# EAGLE design Haar_Primal (EAGLE 9.5.2)
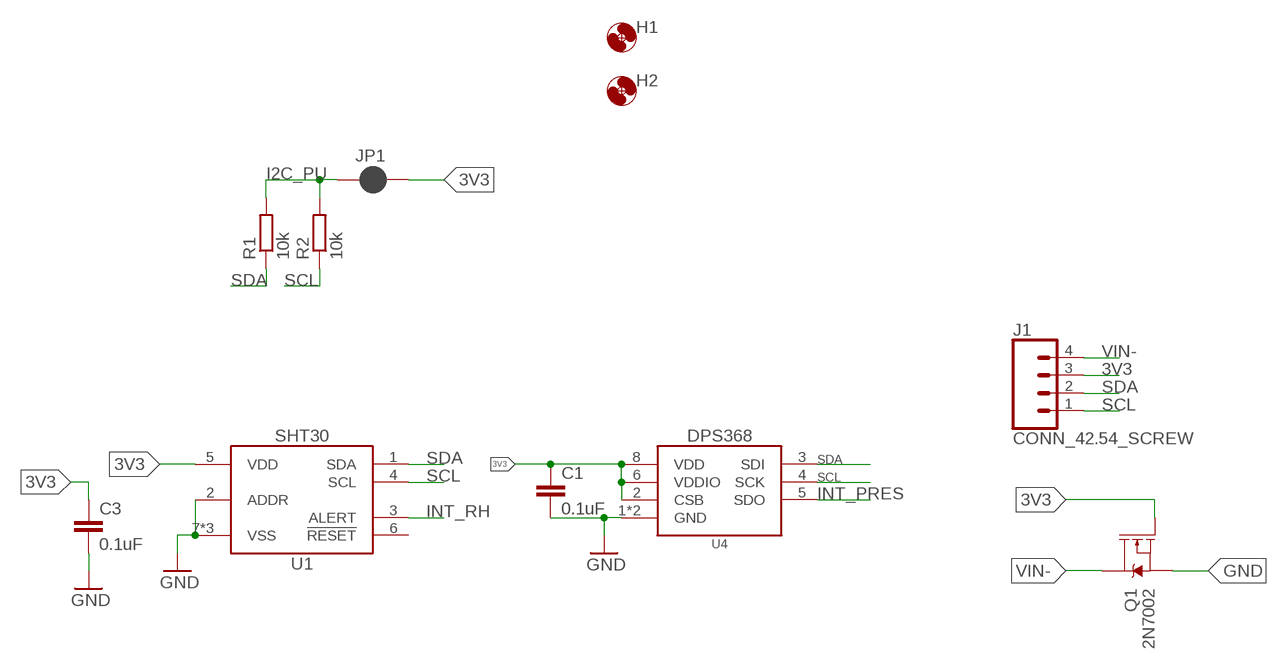
[diagram p0: schematic, sheet 1]

## Parts
C1  0.1uF  C-EU0.1UFC0603  [C0603]
C3  0.1uF  C-EU0.1UFC0603  [C0603]
H1  MOUNTING_HOLE2_NP  [2_56]
H2  MOUNTING_HOLE2_NP  [2_56]
J1  CONN_42.54_SCREW  [1X04_SCREW]
JP1  JUMPER-SMT_2_NC_PASTE_SILK  [SMT-JUMPER_2_NC_PASTE_SILK]
Q1  2N7002  MOSFET-NCH-2N7002PW  [SOT323]
R1  10k  R-EU_10KR0603  [R0603]
R2  10k  R-EU_10KR0603  [R0603]
U1  SHT30DFN  [DFN_8_2.5X2.5]
U4  DPS368  [PG-VLGA-8]

## Nets
3V3: C1.1 C3.1 J1.3 JP1.2 Q1.1(G) U1.5(VDD) U4.2(CSB) U4.6(VDDIO) U4.8(VDD)
GND: C1.2 C3.2 Q1.2(S) U1.2(ADDR) U1.7(VSS) U1.8(VSS) U1.EP(VSS) U4.1(GND) U4.7(GND)
I2C_PU: JP1.1 R1.2 R2.2
INT_PRES: U4.5(SDO)
INT_RH: U1.3(ALERT)
SCL: J1.1 R2.1 U1.4(SCL) U4.4(SCK)
SDA: J1.2 R1.1 U1.1(SDA) U4.3(SDI)
VIN-: J1.4 Q1.3(D)
Unconnected: U1.6(!RESET)

## Library data of the parts
C1 C3 = bschulz_passives:C-EU: CAPACITOR, European symbol; DIGIKEY: 490-6051-1-ND; MF: Murata; MPN: GCM188R71E104KA57D
H1 H2 = bschulz:MOUNTING_HOLE: Genaric Mechanical Mounting Hole Hole diameter based on max body diameter + 15% Keepout ring is for diameter of socket cap screw (minimum required clearance) TPlace ring is for diameter of pan head screw (recomended clearance) Specifications: Socket Cap <http://fastener-express.com/fastener-technical/SocketscapSS-Alloy.pdf> Button Head Socket Cap <http://fastener-express.com/fastener-technical/Button-Socket-alloy.pdf> Pan Head <http://fastener-express.com/fastener-technical/pan-machine-Screws.pdf>
J1 = bschulz:CONN_4: Genaric 4 terminal header Digikey 2.54_SCREW <https://www.digikey.com/product-detail/en/on-shore-technology-inc/OSTVN04A150/ED10563-ND/1588864>; DIGIKEY: ED10563-ND; MF: On Shore; MPN: OSTVN04A150
JP1 = SparkFun-Jumpers:JUMPER-SMT_2_NC_PASTE: Normally closed solder jumper This jumper has an aperture in the stencil to allow solder paste to bridge the split in the wire so it's normally closed (NC). Wick off the solder to open the connection. Reapply solder to reclose the connection.
Q1 = bschulz:MOSFET-NCH: N-channel MOSFETs Voltage controlled devices that allow control of high current outputs. SparkFun Products: SparkFun OpenScale <https://www.sparkfun.com/products/13261> SparkFun Digital Sandbox <https://www.sparkfun.com/products/12651> SparkFun Monster Moto Shield <https://www.sparkfun.com/products/10182> SparkFun MOSFET Power Controller <https://www.sparkfun.com/products/11214>; DIGIKEY: 2N7002W-FDICT-ND; MF: Diodes Incorporated; MPN: 2N7002W-7-F; PROD_ID: TRANS-11151
R1 R2 = bschulz_passives:R-EU_: RESISTOR, European symbol Digikey Parts: Yageo, 0402 <https://www.digikey.com/products/en/resistors/chip-resistor-surface-mount/52?k=&pkeyword=&sv=0&s=4356&sf=1&FV=-1%7C13%2C7%7C2%2C1291%7C39157%2C1989%7C0%2C-8%7C52%2C3%7C1131%2C3%7C2503&quantity=&ColumnSort=0&page=1&stock=1&pageSize=25> Yageo, 0603 <https://www.digikey.com/products/en/resistors/chip-resistor-surface-mount/52?k=&pkeyword=&sv=0&pv1291=39245&sf=1&FV=-5%7C4356%2C-5%7C47360%2C-8%7C52%2C-1%7C13%2C7%7C2%2C1989%7C0&quantity=10&ColumnSort=1000011&page=1&stock=1&pageSize=25> Panasonic, 0603 <https://www.digikey.com/products/en/resistors/chip-resistor-surface-mount/52?k=&pkeyword=&pv252=68&sf=0&FV=ffec373d%2C1c0002%2C142c040c%2C1f140000%2Cffe00034%2C80002%2Cc0001&quantity=&ColumnSort=0&page=1&stock=1&pageSize=25> Panasonic, precision, 0603 <https://www.digikey.com/products/en/resistors/chip-resistor-surface-mount/52?FV=ffec4907%2Cfffc000a%2Cc0172%2C142c040c%2C1f140000%2Cffe00034%2C1c0002&quantity=100&ColumnSort=2085&page=1&stock=1&pageSize=25> Panasonic, 0805 <https://www.digikey.com/products/en/resistors/chip-resistor-surface-mount/52?k=&pkeyword=&pv3=1&sf=0&FV=ffec373d%2C1c0002%2C1f140000%2Cffe00034%2C142c040d&quantity=&ColumnSort=0&page=1&stock=1&pageSize=25> Rohm, current sense <https://www.digikey.com/products/en/resistors/chip-resistor-surface-mount/52?k=&pkeyword=&pv3=1&sf=0&FV=ffecb688%2C1f140000%2Cffe00034%2C1c0002&quantity=&ColumnSort=0&page=1&stock=1&pageSize=25> Vishay, pulse proof automotive <https://www.digikey.com/products/en/resistors/chip-resistor-surface-mount/52?k=&pkeyword=&pv7=2&sf=0&FV=ffec5d6b%2Cffe00034%2C1f140000&quantity=&ColumnSort=0&page=1&stock=1&pageSize=25>; DIGIKEY: 311-10.0KHRCT-ND; MF: Yageo; MPN: RC0603FR-0710KL; VALUE_PART: 10k
U1 = bschulz:SHT3*: SHT3x - Digital Humidity and Temperature Sensor Characteristics (for SHT35): Vcc: 2.15V ~ 5.5V Humidity Resolution: 0.01% RH Humidity Accuracy: ±1.5% RH Temperature Resolution: 0.01°C Temperature Accuracy: 0.1°C Operating Temperature: -40°C to 125°C Digikey: 1649-1065-1-ND (SHT30) <https://www.digikey.com/product-detail/en/sensirion-ag/SHT30-DIS-F2.5KS/1649-1065-1-ND/6212136> 1649-1066-1-ND (SHT31) <https://www.digikey.com/product-detail/en/sensirion-ag/SHT31-DIS-F2.5KS/1649-1066-1-ND/6212137> 1649-1067-1-ND (SHT35) <https://www.digikey.com/product-detail/en/sensirion-ag/SHT35-DIS-F2.5KS/1649-1067-1-ND/6212138>; DIGIKEY: 1649-1065-1-ND; DISP: SHT30; MF: Sensirion; MPN: SHT30-DIS-F2.5KS
U4 = bschulz:DPS368: DPS368 - Digital Pressure Sensor Characteristics: Vcc: 1.7V ~ 3.6V Pressure Range: 300 ~ 1200 mBar Pressure Resolution: 0.002 mBar, max Pressure Accuracy: relative ±0.06 mBar, abs ± 1 mBar Temperature Resolution: 0.01°C Temperature Accuracy: 0.5°C Operating Temperature: -40°C to 85°C Digikey: DPS368XTSA1CT-ND <https://www.digikey.com/product-detail/en/DPS368XTSA1/DPS368XTSA1CT-ND/10244081/?itemSeq=300835075>; DIGIKEY: DPS368XTSA1CT-ND; DISP: DPS368; MF: Infineon; MPN: DPS368XTSA1

## Board
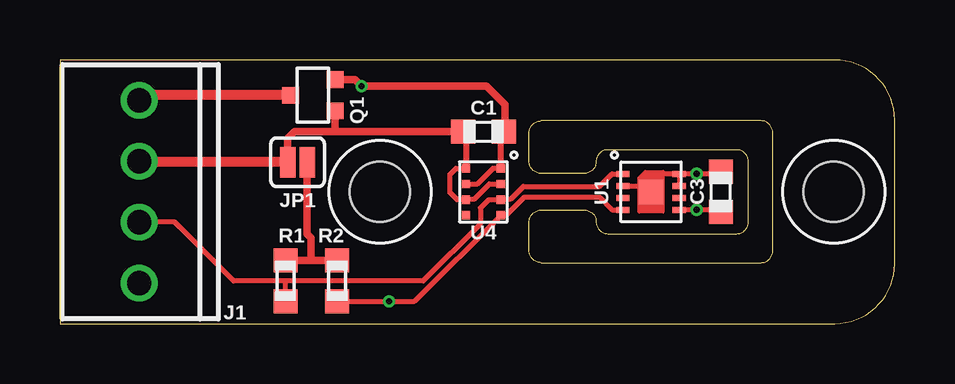
[diagram p1: board, top side]
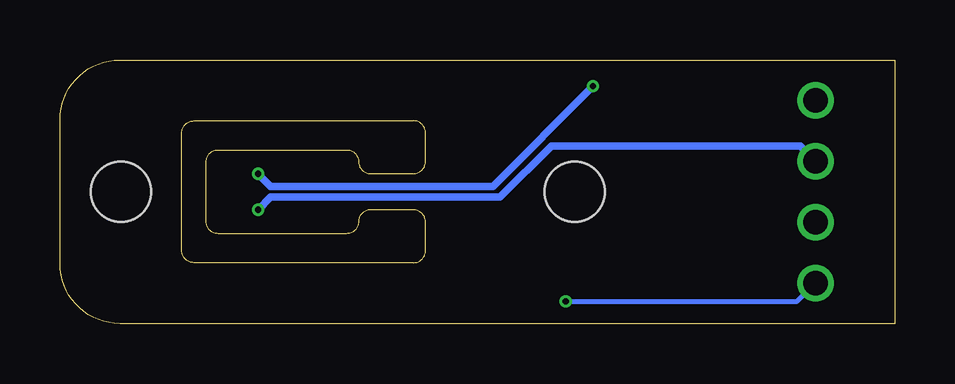
[diagram p2: board, bottom side, seen from below]

Size 34.8 x 11 mm. Coordinates in mm from the lower left corner, seen from the top.
Outline: 0,0 32.3,0 arc90 34.8,2.5 34.8,8.5 arc90 32.3,11 0,11 0,0
Outline: 19.56,6.76 19.56,7.96 arc-90 20.06,8.46 29.22,8.46 arc-90 29.72,7.96 29.72,3.04 arc-90 29.22,2.54 20.06,2.54 arc-90 19.56,3.04 19.56,4.24 arc-90 20.06,4.74 21.86,4.74 arc-90 22.35,4.25 arc90 22.85,3.75 28.2,3.75 arc90 28.7,4.25 28.7,6.75 arc90 28.2,7.25 22.84,7.25 arc90 22.35,6.76 arc-90 21.85,6.26 20.06,6.26 arc-90 19.56,6.76
Copper layers (1*16): Top 0.035559375mm / dielectric 1.6mm / Bottom 0.035559375mm
Design rules "oshpark-2layer": minimum track width 6mil, minimum drill 10mil, track to track 6mil, track to pad 6mil, pad to pad 6mil, via to via 6mil, smd to smd 6mil, copper to edge 15mil, drill to drill 6mil, minimum pad ring 5mil, minimum via ring 5mil, stop-mask expansion 2.5mil, vias tented up to drill 0mil, thermal gap 10mil

### Footprints (pad centres in the part's own frame; a part is rotated, then mirrored left to right if it is on the bottom)
C0603 = smd 1 x 1: 1 -0.85,0; 2 0.85,0
2_56 = hole 2.5: 0,0
1X04_SCREW = drill 1.016: 1 -3.81,0; 2 -1.27,0; 3 1.27,0; 4 3.81,0
SMT-JUMPER_2_NC_PASTE_SILK = smd 0.635 x 1.27: 1 -0.406,0; 2 0.406,0
SOT323 = smd 0.7 x 0.7: 1 -0.65,-0.925; 2 0.65,-0.925; 3 0,0.925
R0603 = smd 1 x 1: 1 -0.85,0; 2 0.85,0
DFN_8_2.5X2.5 = smd 0.55 x 0.25: 1 -1.175,0.75; 2 -1.175,0.25; 3 -1.175,-0.25; 4 -1.175,-0.75; 5 1.175,-0.75; 6 1.175,-0.25; 7 1.175,0.25; 8 1.175,0.75 | smd 1 x 1: EP 0,0
PG-VLGA-8 = smd 0.35 x 0.35: 1 0.725,0.975; 2 0.725,0.325; 3 0.725,-0.325; 4 0.725,-0.975; 5 -0.725,-0.975; 6 -0.725,-0.325; 7 -0.725,0.325; 8 -0.725,0.975

### Placement (x,y rotation side)
C1  17.65,8 0 top
C3  27.56,5.5 90 top
H1  32.26,5.5 0 top
H2  13.34,5.5 0 top
J1  3.3,5.5 90 top
JP1  9.91,6.73 180 top
Q1  10.54,9.53 90 top
R1  9.4,1.78 90 top
R2  11.56,1.78 90 top
U1  24.64,5.5 0 top
U4  17.65,5.5 0 top

### Tracks (layer width: path | path; a pad name or v marks a point on that pad's centre or on a via)
3V3  (via drill 0.25)
  Top 0.2: C3.1 27.46,4.75 v26.54,4.75 U1.5 | U4.2 17.9,5.83 17.28,5.21 16.96,5.21 U4.6 16.54,5.17 16.26,5.46 16.26,6.22 16.51,6.48 U4.8
  Top 0.254: C1.1 16.93,7.88 U4.8
  Top 0.305: JP1.2 9.5,7.72 9.78,8 11.43,8 | 11.43,8 C1.1 | Q1.1 11.47,8.04 11.43,8
  Top 0.406: J1.3 9.46,6.77 JP1.2
  Bottom 0.305: J1.3 3.94,7.41 14.31,7.41 16.45,5.27 26.02,5.27 v26.54,4.75
GND  (via drill 0.25)
  Top 0.2: U1.2 24.39,5.75 24.47,5.67 | 24.47,5.67 U1.EP | U1.8 U1.7 | U1.8 25.05,6.25 24.47,5.67 | C3.2 27.46,6.25 v26.54,6.25 U1.8 | U4.7 17.4,5.83 18.05,6.47 U4.1
  Top 0.254: U4.1 18.38,7.88 C1.2
  Top 0.305: Q1.2 12.3,10.18 v12.57,9.91 17.78,9.91 18.54,9.14 18.54,8.04 C1.2
  Bottom 0.305: v12.57,9.91 16.75,5.73 26.02,5.73 v26.54,6.25
I2C_PU
  Top 0.305: R1.2 10.48,2.63 | 10.48,2.63 R2.2 | 10.48,2.63 10.48,3.58 10.31,3.75 JP1.1
SCL  (via drill 0.25)
  Top 0.2: U1.4 23.01,4.75 22.49,5.27 19.36,5.27 18.62,4.53 U4.4 18.38,4.52 14.79,0.93 v13.72,0.93 R2.1
  Bottom 0.2: v13.72,0.93 4.06,0.93 J1.1
SDA
  Top 0.2: U1.1 23.01,6.25 22.49,5.73 19.32,5.73 18.8,5.21 18.41,5.21 U4.3 17.88,5.17 17.53,4.83 17.53,4.16 15.14,1.78 9.4,1.78 | 9.4,1.78 7.24,1.78 4.79,4.23 J1.2 | R1.1 9.4,1.78
  Top 0.254: R1.1 9.11,0.93
VIN-
  Top 0.406: Q1.3 3.52,9.53 J1.4

### Text on the board
Document: #2 Screw
tDocu: Project Haar | GND | 3v3 | SDA | SCL | Primal
bDocu: To Logger | Project Haar - Primal / v0.0 / Bobby Schulz / UMN/GEMS